# Altium schematic sheet 05_04_Bufif_and_Notif.SchDoc
size 142 x 66 mm
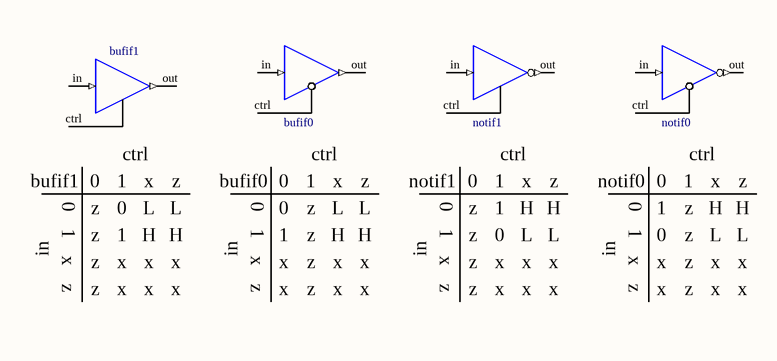
[diagram p0: 05_04_Bufif_and_Notif.SchDoc]

## Parts
(Parts that share a designator on the sheet are numbered #1, #2 ... from top to bottom, then left to right.)
U?#1  bufif0
U?#2  notif1
U?#3  notif0
U?#4  bufif1

## Nets

Not connected (* = marked no-connect by the designer): U?#1 ctrl in out; U?#2 ctrl in out; U?#3 ctrl in out; U?#4 ctrl in out

## Notes on the sheet
- (near U?#4) bufif1
- (near U?#4) 0
- (near U?#4) 1
- (near U?#4) ctrl
- (near U?#4) x
- (near U?#4) z
- bufif0
- 0
- 1
- (near U?#1) ctrl
- x
- z
- notif1
- (near U?#2) ctrl
- notif0
- (near U?#3) ctrl
- in
- L
- H